# EAGLE schematic untitled (EAGLE 7.7.0)
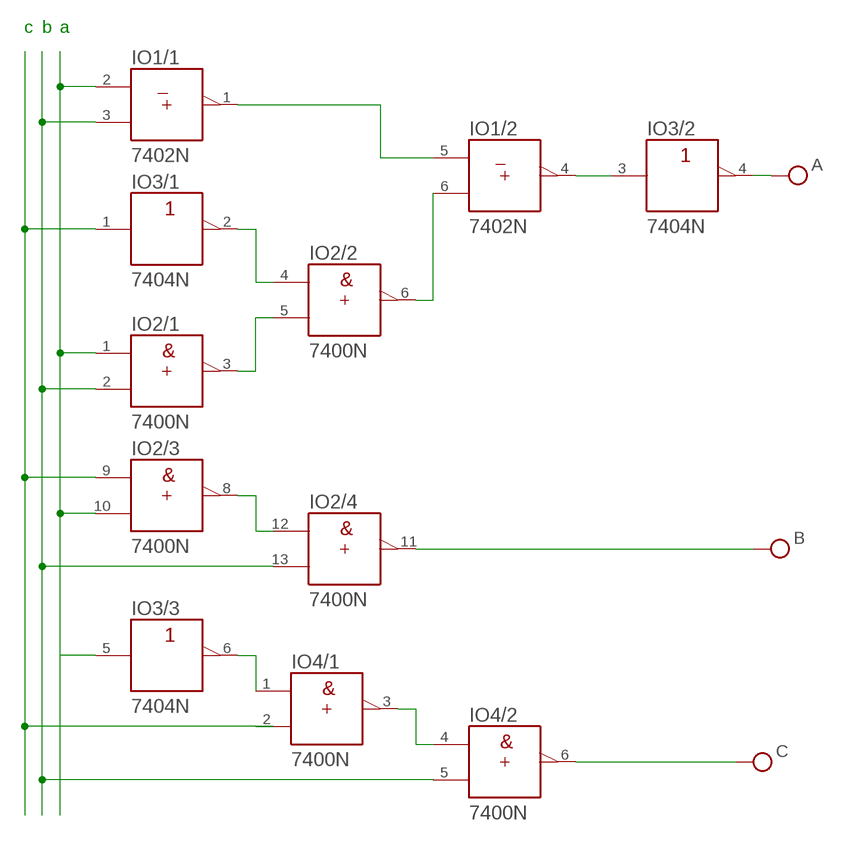
[diagram p0: schematic, sheet 1]

## Parts
IO1  7402N  [DIL14]
IO2  7400N  [DIL14]
IO3  7404N  [DIL14]
IO4  7400N  [DIL14]

## Nets
N$1: IO1.2(/1:A) IO1.3(/1:B) IO2.1(/1:A) IO2.2(/1:B) IO2.9(/3:A) IO2.10(/3:B) IO2.13(/4:B) IO3.1(/1:A) IO3.5(/3:A) IO4.5(/2:B)
N$2: IO2.4(/2:A) IO3.2(/1:Y)
N$3: IO2.3(/1:Y) IO2.5(/2:B)
N$4: IO1.1(/1:Y) IO1.5(/2:A)
N$5: IO1.6(/2:B) IO2.6(/2:Y)
N$6: IO1.4(/2:Y) IO3.3(/2:A)
N$7: IO2.8(/3:Y) IO2.12(/4:A)
N$8: IO3.6(/3:Y) IO4.1(/1:A)
N$9: IO4.3(/1:Y) IO4.4(/2:A)
VCC: IO2.11(/4:Y) IO3.4(/2:Y) IO4.6(/2:Y) ; supply symbol labelled A, B, C
Unconnected: IO1.8(/3:A) IO1.9(/3:B) IO1.10(/3:Y) IO1.11(/4:A) IO1.12(/4:B) IO1.13(/4:Y) IO3.8(/4:Y) IO3.9(/4:A) IO3.10(/5:Y) IO3.11(/5:A) IO3.12(/6:Y) IO3.13(/6:A) IO4.2(/1:B) IO4.8(/3:Y) IO4.9(/3:A) IO4.10(/3:B) IO4.11(/4:Y) IO4.12(/4:A) IO4.13(/4:B)

## Notes on the sheet
- c | b | a

## Power pins joined to a net without a drawn wire
+UB: IO1.14(/+UB:+UB) IO2.14(/+UB:+UB) IO3.14(/+UB:+UB) IO4.14(/+UB:+UB)
-UB: IO1.7(/-UB:-UB) IO2.7(/-UB:-UB) IO3.7(/-UB:-UB) IO4.7(/-UB:-UB)

## Library data of the parts
IO1 = 74ttl-din:74*02: Quad 2-input NOR gate
IO2 IO4 = 74ttl-din:74*00: Quad 2-input NAND gate
IO3 = 74ttl-din:74*04: Hex INVERTER